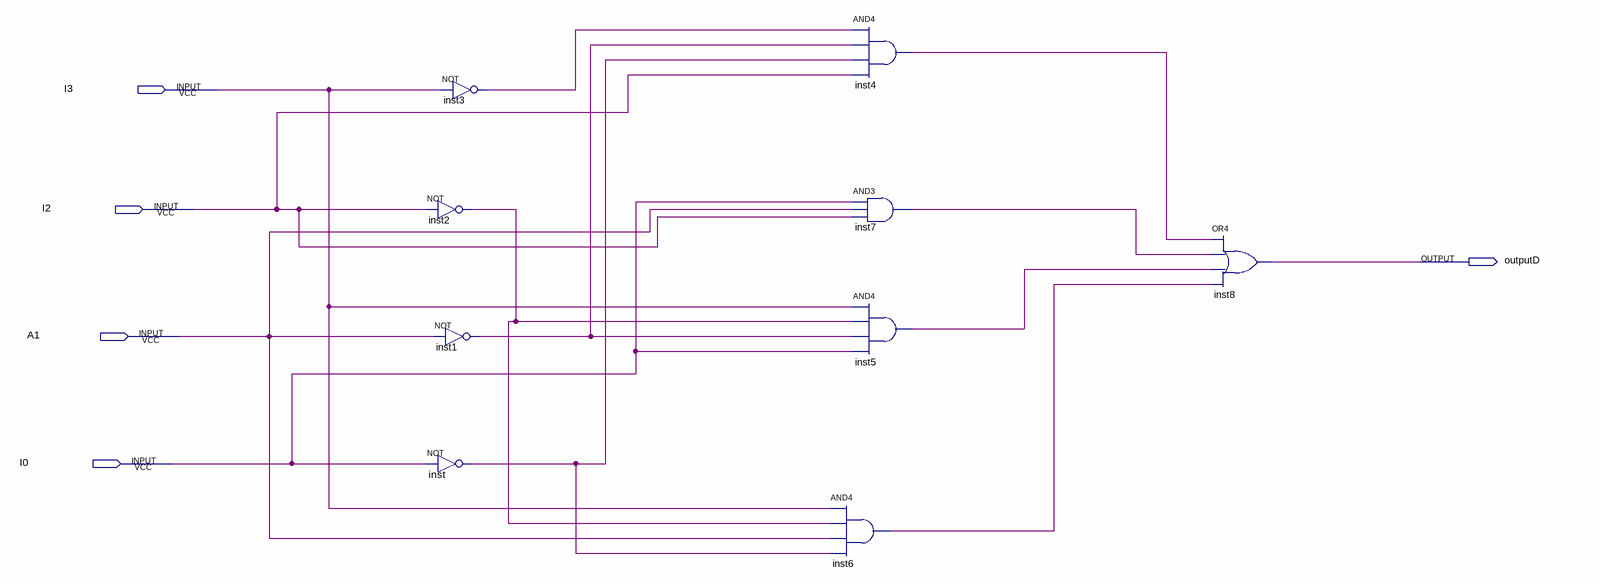
[diagram p0: schematic sheet]
// Quartus schematic outputD.bdf as structural Verilog: 9 symbols, 5 pins
module outputD (
  input  I3,
  input  I2,
  input  A1,
  input  I0,
  output outputD
);

  wire inst1_out, inst2_out, inst3_out, inst4_out, inst5_out, inst6_out, inst7_out, inst_out;

  not inst2 (inst2_out, I2);
  not inst1 (inst1_out, A1);
  not inst (inst_out, I0);
  not inst3 (inst3_out, I3);
  and inst4 (inst4_out, inst3_out, inst1_out, inst_out, I2);
  and inst7 (inst7_out, I0, A1, I2);
  and inst5 (inst5_out, I3, inst2_out, inst1_out, I0);
  and inst6 (inst6_out, I3, inst2_out, A1, inst_out);
  or inst8 (outputD, inst4_out, inst7_out, inst5_out, inst6_out);
endmodule
